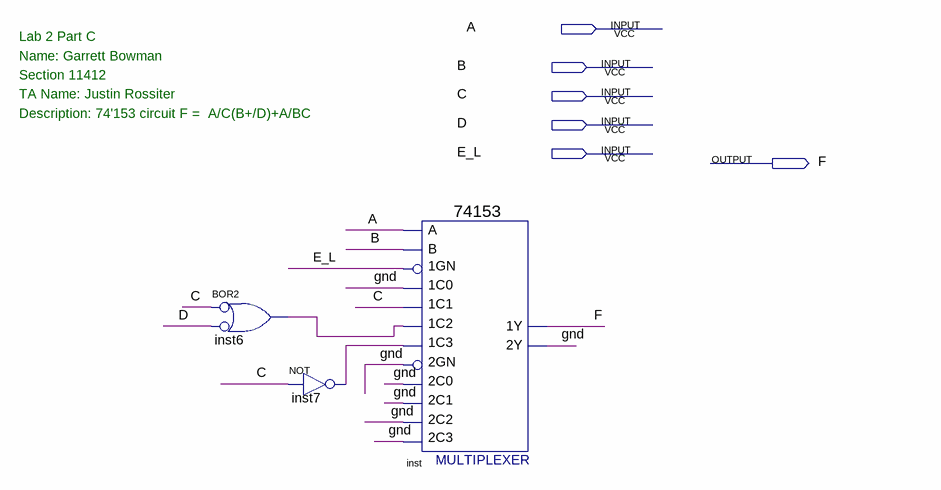
[diagram p0: schematic sheet]
// Quartus schematic Lab2_EQU.bdf as structural Verilog: 3 symbols, 6 pins
module Lab2_EQU (
  input  A,
  input  B,
  input  C,
  input  D,
  input  E_L,
  output F
);

  wire gnd, inst6_out, inst7_out;

  or inst6 (inst6_out, ~C, ~D);  // BOR2
  not inst7 (inst7_out, C);
  \74153  inst (
    .\1C1 (C), .\1GN (E_L), .\1C0 (gnd), .\2C0 (gnd), .\2GN (gnd), .\2C2 (gnd), .\1C2 (inst6_out),
    .\1C3 (inst7_out), .B(B), .A(A), .\2C1 (gnd), .\2C3 (gnd), .\1Y (F), .\2Y (gnd));

  // Notes on the sheet:
  //   Lab 2 Part C
  //   Name: Garrett Bowman
  //   Section 11412
  //   TA Name: Justin Rossiter
  //   Description: 74'153 circuit F =  A/C(B+/D)+A/BC
endmodule
